# Altium schematic sheet Switch.SchDoc
size A3; SheetNumber: 1; SheetTotal: 1
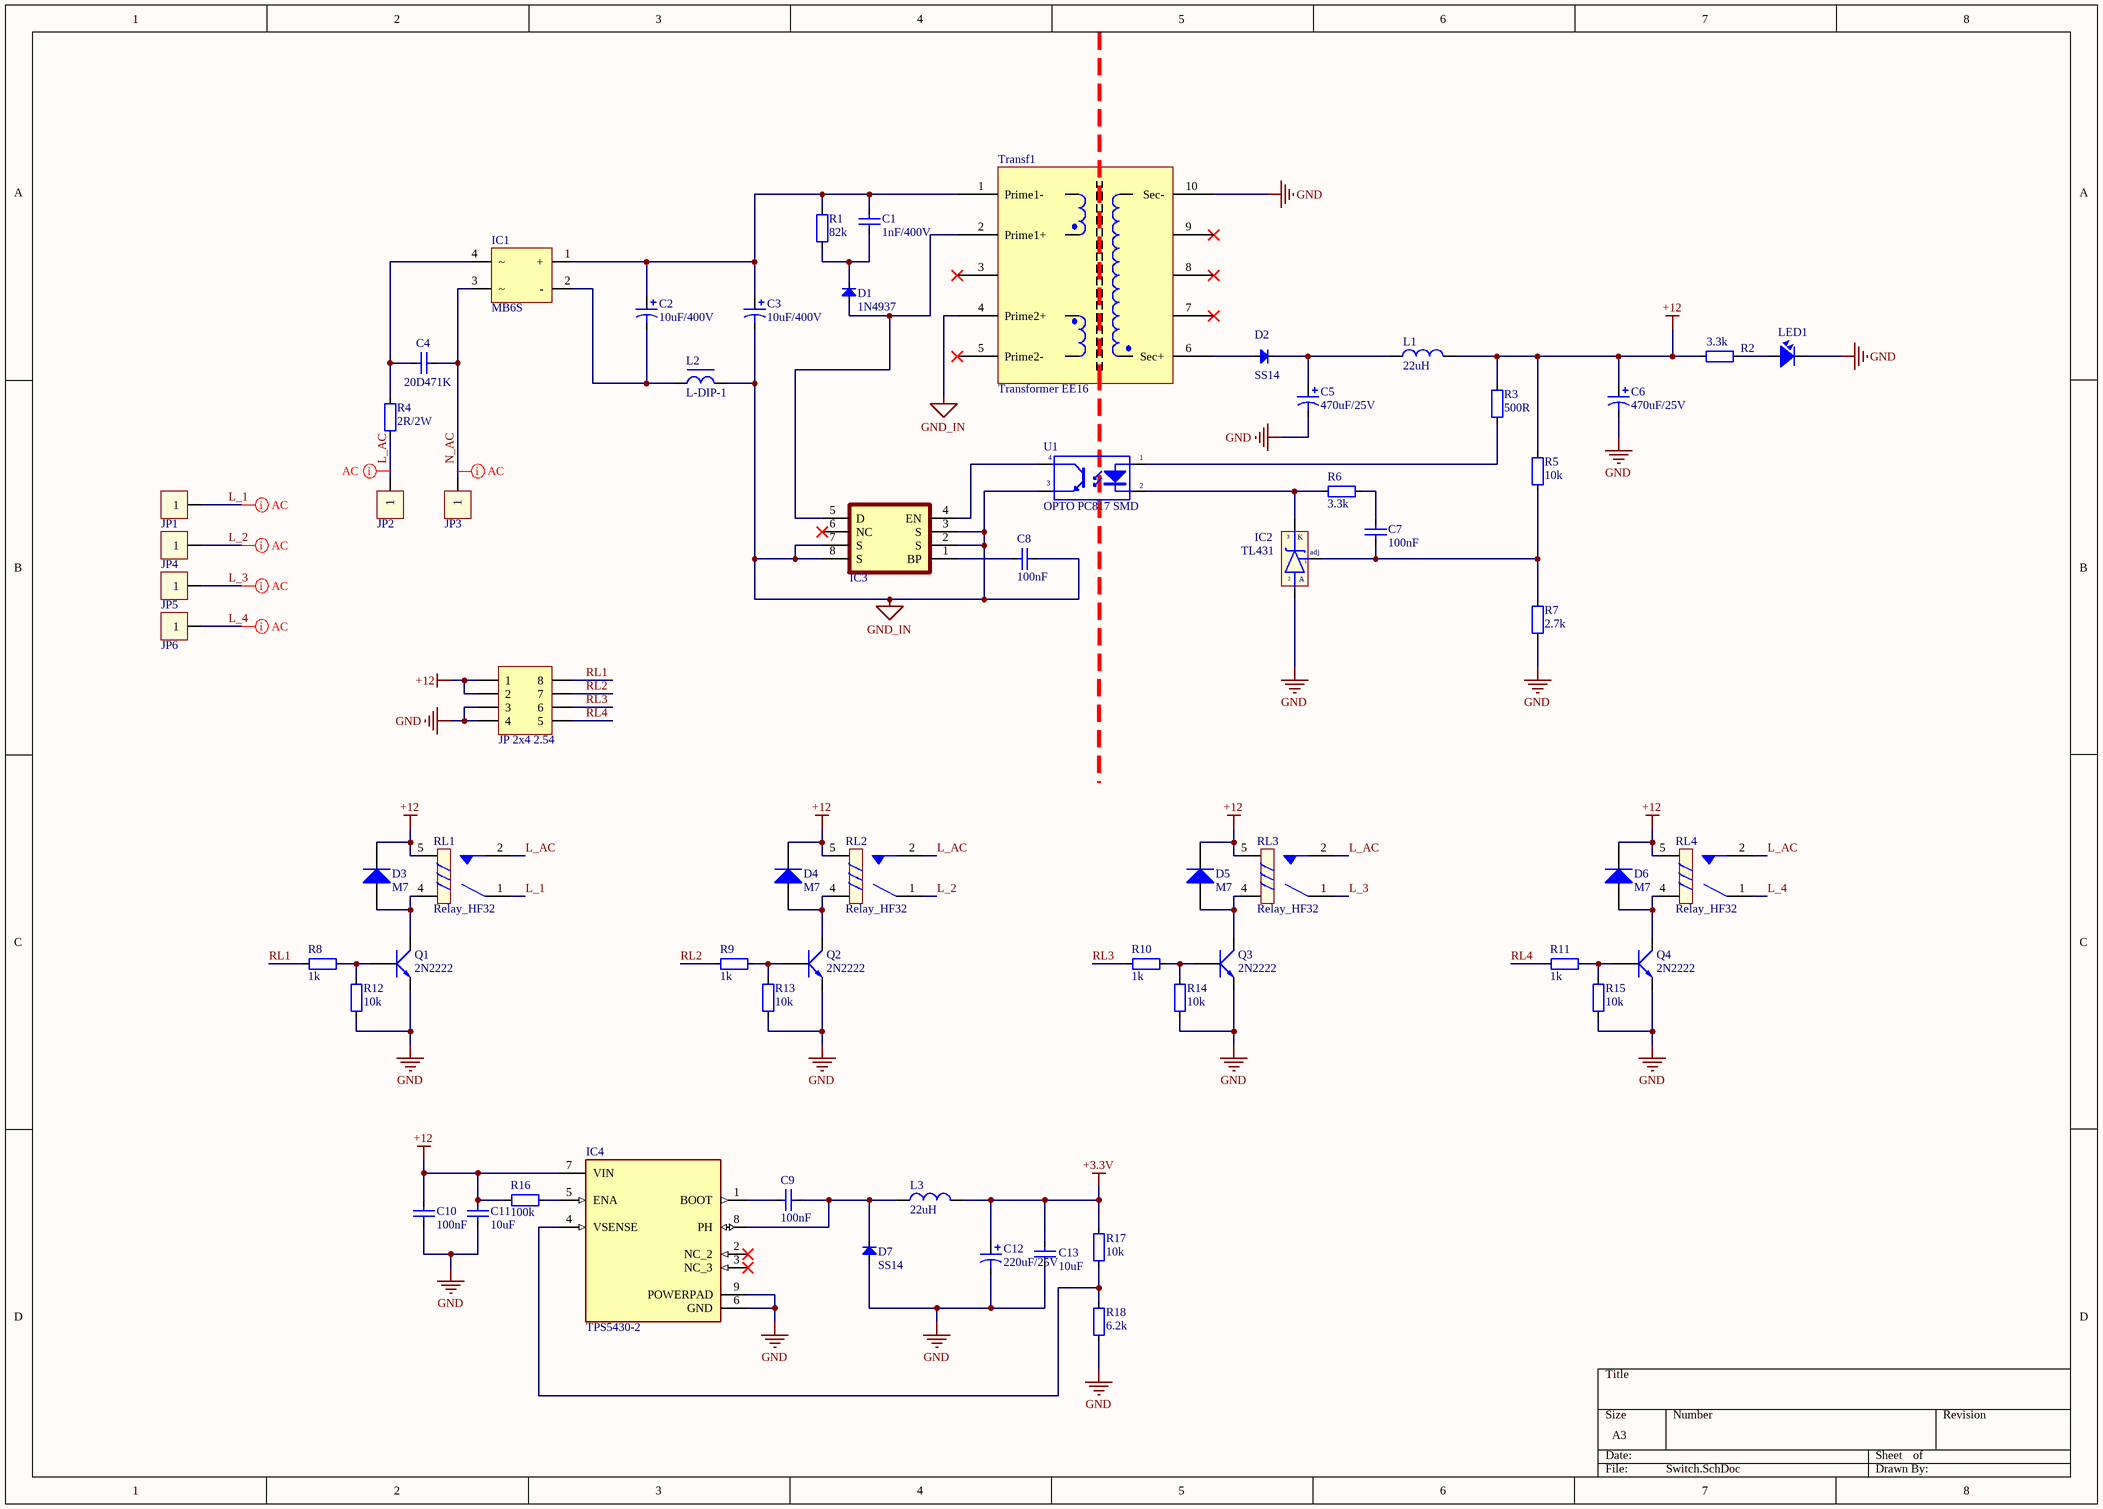
[diagram p0: Switch.SchDoc]

## Parts
C1  1nF/400V  [103/2KV]
C2  10uF/400V  [C10mm]
C3  10uF/400V  [C10mm]
C4  20D471K  [103/2KV]
C5  470uF/25V  [C8mm]
C6  470uF/25V  [C8mm]
C7  100nF  [CAP_0603]
C8  100nF  [CAP_0603]
C9  100nF  [CAP_0603]
C10  100nF  [CAP_0603]
C11  10uF  [CAP_0603]
C12  220uF/25V  [C8mm]
C13  10uF  [CAP_0603]
D1  1N4937  [DIO-1AN]
D2  SS14  [DO-214AC(SMA)]
D3  M7  [DIODE SMA]
D4  M7  [DIODE SMA]
D5  M7  [DIODE SMA]
D6  M7  [DIODE SMA]
D7  SS14  [DO-214AC(SMA)]
IC1  MB6S  [MB6S]
IC2  TL431  [TL431_SOT]
IC3  TNY264  [DIP8]  (value not drawn)
IC4  TPS5430-2  [TPS5430]
JP1  Coc_dong  [Coc_dong]  (value not drawn)
JP2  Coc_dong  [Coc_dong]  (value not drawn)
JP3  Coc_dong  [Coc_dong]  (value not drawn)
JP4  Coc_dong  [Coc_dong]  (value not drawn)
JP5  Coc_dong  [Coc_dong]  (value not drawn)
JP6  Coc_dong  [Coc_dong]  (value not drawn)
JP7  JP 2x4 2.54  [JP 2x4 DT]
L1  22uH  [Inductor]
L2  L-DIP-1  [Inductor]
L3  22uH  [L_SMD]
LED1  LED  [LED-0805-Red]  (value not drawn)
Q1  2N2222  [SOT23]
Q2  2N2222  [SOT23]
Q3  2N2222  [SOT23]
Q4  2N2222  [SOT23]
R1  82k  [RES-SMD-2512]
R2  3.3k  [RES-SMD-0603]
R3  500R  [RES-SMD-0603]
R4  2R/2W  [RES-1WW]
R5  10k  [RES-SMD-0603]
R6  3.3k  [RES-SMD-0603]
R7  2.7k  [RES-SMD-0603]
R8  1k  [RES-SMD-0603]
R9  1k  [RES-SMD-0603]
R10  1k  [RES-SMD-0603]
R11  1k  [RES-SMD-0603]
R12  10k  [RES-SMD-0603]
R13  10k  [RES-SMD-0603]
R14  10k  [RES-SMD-0603]
R15  10k  [RES-SMD-0603]
R16  100k  [RES-SMD-0603]
R17  10k  [RES-SMD-0603]
R18  6.2k  [RES-SMD-0603]
RL1  Relay_HF32  [HF32F]
RL2  Relay_HF32  [HF32F]
RL3  Relay_HF32  [HF32F]
RL4  Relay_HF32  [HF32F]
Transf1  Transformer EE16  [Transformer SW]
U1  OPTO PC817 SMD  [SOP4]

## Nets
+3.3V: C12.1 C13.1 L3.2 R17.2
+12: C6.1 C10.2 C11.2 D3.2(K) D4.2(K) D5.2(K) D6.2(K) IC4.7(VIN) JP7.1 JP7.2 L1.2 R2.2 R3.1 R5.1 R16.1 RL1.5 RL2.5 RL3.5 RL4.5
GND: C5.2 C6.2 C10.1 C11.1 C12.2 C13.2 D7.1(A) IC2.2(A) IC4.6(GND) IC4.9(POWERPAD) JP7.3 JP7.4 LED1.2 Q1.2(E) Q2.2(E) Q3.2(E) Q4.2(E) R7.2 R12.1 R13.1 R14.1 R15.1 R18.1 Transf1.10(Sec-)
GND_IN: C3.2 C8.1 IC3.2(S) IC3.3(S) IC3.7(S) IC3.8(S) L2.2 Transf1.4(Prime2+) U1.3(E)
L_1: JP1.1 RL1.1
L_2: JP4.1 RL2.1
L_3: JP5.1 RL3.1
L_4: JP6.1 RL4.1
L_AC: JP2.1 R4.2 RL1.2 RL2.2 RL3.2 RL4.2
N_AC: C4.1 IC1.3 JP3.1
RL1: JP7.8 R8.1
RL2: JP7.7 R9.1
RL3: JP7.6 R10.1
RL4: JP7.5 R11.1
NetC1_1: C1.1 C2.1 C3.1 IC1.1(+) R1.1 Transf1.1(Prime1-)
NetC1_2: C1.2 D1.2(K) R1.2
NetC2_2: C2.2 IC1.2(-) L2.1
NetC4_2: C4.2 IC1.4 R4.1
NetC5_1: C5.1 D2.2(K) L1.1
NetC7_1: C7.1 IC2.1(adj) R5.2 R7.1
NetC7_2: C7.2 R6.2
NetC8_2: C8.2 IC3.1(BP)
NetC9_1: C9.1 D7.2(K) IC4.8(PH) L3.1
NetC9_2: C9.2 IC4.1(BOOT)
NetD1_1: D1.1(A) IC3.5(D) Transf1.2(Prime1+)
NetD2_1: D2.1(A) Transf1.6(Sec+)
NetD3_1: D3.1(A) Q1.3(C) RL1.4
NetD4_1: D4.1(A) Q2.3(C) RL2.4
NetD5_1: D5.1(A) Q3.3(C) RL3.4
NetD6_1: D6.1(A) Q4.3(C) RL4.4
NetIC2_3: IC2.3(K) R6.1 U1.2(K)
NetIC3_4: IC3.4(EN) U1.4(C)
NetIC4_4: IC4.4(VSENSE) R17.1 R18.2
NetIC4_5: IC4.5(ENA) R16.2
NetLED1_1: LED1.1 R2.1
NetQ1_1: Q1.1(B) R8.2 R12.2
NetQ2_1: Q2.1(B) R9.2 R13.2
NetQ3_1: Q3.1(B) R10.2 R14.2
NetQ4_1: Q4.1(B) R11.2 R15.2
NetR3_2: R3.2 U1.1(A)

Not connected (* = marked no-connect by the designer): IC3 6(NC)*; IC4 2(NC_2)* 3(NC_3)*; Transf1 3* 5(Prime2-)* 7* 8* 9*

## Layout directives
net class AC: L_1, L_2, L_3, L_4, L_AC, N_AC

## Library data of the parts
C1 = Cap2KV: CAP CERAMIC; Published: 8-Jun-2000; LatestRevisionDate: 17-Jul-2002; LatestRevisionNote: Re-released for DXP Platform.; PackageReference: RAD-0.3; Publisher: Altium Limited
C2 C3 = Cap Pol: Polarized Capacitor (Axial); Published: 8-Jun-2000; LatestRevisionDate: 17-Jul-2002; LatestRevisionNote: Re-released for DXP Platform.; PackageReference: POLAR0.8; Publisher: Altium Limited
C4 = Cap2KV: Varistor; Published: 8-Jun-2000; LatestRevisionDate: 17-Jul-2002; LatestRevisionNote: Re-released for DXP Platform.; PackageReference: RAD-0.3; Publisher: Altium Limited
C5 C6 C12 = Cap Pol: 470uF 25V 8x12mm; Published: 8-Jun-2000; LatestRevisionDate: 17-Jul-2002; LatestRevisionNote: Re-released for DXP Platform.; PackageReference: POLAR0.8; Publisher: Altium Limited
C7-C11 C13 = CapSMD: Capacitor; Value: 33p; Published: 8-Jun-2000; LatestRevisionDate: 17-Jul-2002; LatestRevisionNote: Re-released for DXP Platform.; PackageReference: RAD-0.3; Publisher: Altium Limited
D1 = Diode SMD: Diode Schottky / 1N4937; Code - JEDEC: DO-214-AB; Value: 1N5007; Published: 8-Jun-2000; Revision: July-2002: Re-released for DXP Platform.; Publisher: Altium Limited
D2 D7 = Diode SMD: SS34 Diode Schottky 3A 40V SMA(DO-214AC); Code - JEDEC: DO-214-AB; Value: 1N5007; Published: 8-Jun-2000; Revision: July-2002: Re-released for DXP Platform.; Publisher: Altium Limited
D3-D6 = Diode M7 ( 4007 ): Dán; Don_Vi: Con; Ten_Linh_Kien: Diode M7 1N4007 SMD 1A 1000V; Ma_Hang: MH000944; Chung_Loai: Dán; Ghi_Chu: *
IC2 = TL431: Programmable Shunt Regulator; Value: TL431
IC3 = TNY264: Enhanced, Energy Efficient, Low Power Off-line Switcher
JP7 = JP 2x4 2.54 Duc Thang: Cắm; Ten_Linh_Kien: Jump Đôi Đực 2.54MM 2x40P Thẳng 11MM; Don_Vi: Con; Ma_Hang: MH002686; Ghi_Chu: *; Kieu_Chan: *; Chung_Loai: Cắm
L1 L3 = Inductor: CD73R 22uH 1.23A 7345; Value: 150 mH
L2 = L-DIP-1: Inductor; Value: 150 mH
LED1 = LED: LED Single colour Green and Red; Value: LED 3 ly Single Colour
Q1-Q4 = C1815 HF SMD: NPN transistor; Value: C9014
R1-R18 = Resistor - SMD: Resistor; Manufacturer: Generic Components; Class: Passive; Published: 08/06/2000; Publisher: Altium Hobart Technology Centre
Transf1 = Tranformer EE16
U1 = OPTO PC817 SMD: Single Opto; Value: PC817